# Altium schematic sheet Schematic_motor_driver_v1.SchDoc: Motor Controller Board
size B; Author: Artem Dementyev; Revision: 1.0
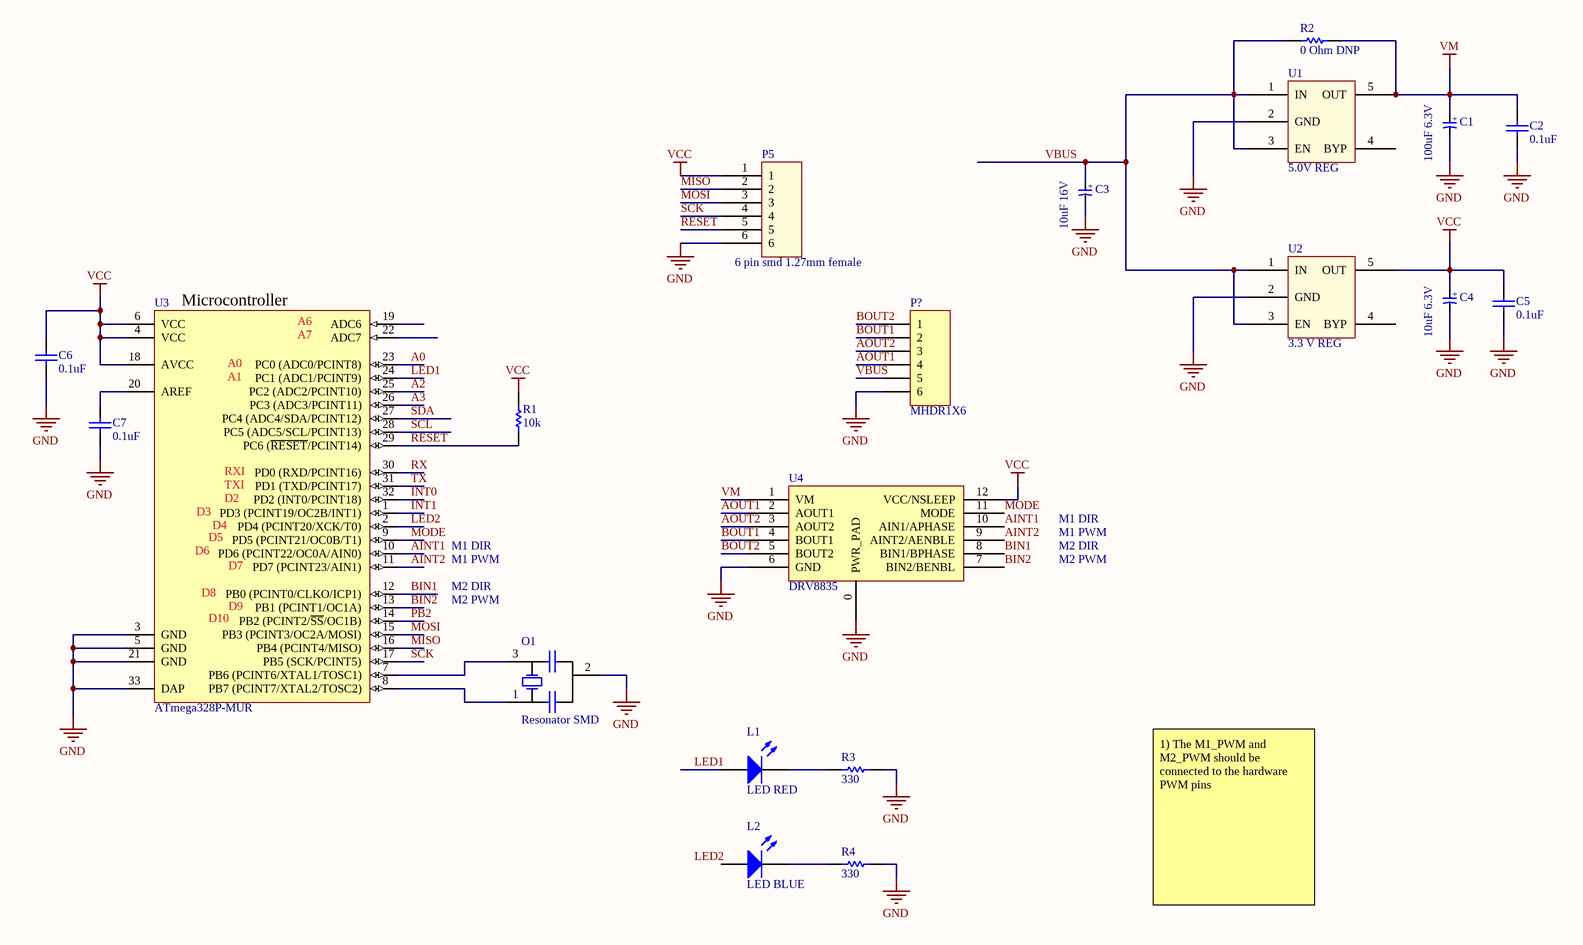
[diagram p0: Schematic_motor_driver_v1.SchDoc]

## Parts
C1  100uF 6.3V  [CAP1206]
C2  0.1uF  [0402W]
C3  10uF 16V  [CAP0805]
C4  10uF 6.3V  [CAP0805]
C5  0.1uF  [0402W]
C6  0.1uF  [0402W]
C7  0.1uF  [0402W]
L1  LED RED  [0402W]
L2  LED BLUE  [0402W]
O1  Resonator SMD  [Resonator SMD]
P5  6 pin smd 1.27mm female  [6pos 1.27mm]
P?  MHDR1X6  [MHDR1X6]
R1  10k  [0402W]
R2  0 Ohm DNP  [0402W]
R3  330  [0402W]
R4  330  [0402W]
U1  5.0V REG  [SOT-23-5]
U2  3.3 V REG  [SOT-23-5]
U3  ATmega328P-MUR  [32M1-A_M]
U4  DRV8835  [WSON-16]

## Nets
GND: C1.2 C2.1 C3.2 C4.2 C5.1 C6.1 C7.1 O1.2 P5.6 P?.6 R3.1 R4.1 U1.2(GND) U2.2(GND) U3.3(GND) U3.5(GND) U3.21(GND) U3.33(DAP) U4.0(PWR_PAD) U4.6(GND)
VCC: C4.1 C5.2 C6.2 P5.1 R1.2 U2.5(OUT) U3.4(VCC) U3.6(VCC) U3.18(AVCC) U4.12(VCC/NSLEEP)
VM: C1.1 C2.2 R2.1 U1.5(OUT) U4.1(VM)
A0: U3.23(PC0_(ADC0/PCINT8))
A2: U3.25(PC2_(ADC2/PCINT10))
A3: U3.26(PC3_(ADC3/PCINT11))
AINT1: U3.10(PD6_(PCINT22/OC0A/AIN0)) U4.10(AIN1/APHASE)
AINT2: U3.11(PD7_(PCINT23/AIN1)) U4.9(AINT2/AENBLE)
AOUT1: P?.4 U4.2(AOUT1)
AOUT2: P?.3 U4.3(AOUT2)
BIN1: U3.12(PB0_(PCINT0/CLKO/ICP1)) U4.8(BIN1/BPHASE)
BIN2: U3.13(PB1_(PCINT1/OC1A)) U4.7(BIN2/BENBL)
BOUT1: P?.2 U4.4(BOUT1)
BOUT2: P?.1 U4.5(BOUT2)
INT0: U3.32(PD2_(INT0/PCINT18))
INT1: U3.1(PD3_(PCINT19/OC2B/INT1))
LED1: L1.1(A) U3.24(PC1_(ADC1/PCINT9))
LED2: U3.2(PD4_(PCINT20/XCK/T0))
MISO: P5.2 U3.16(PB4_(PCINT4/MISO))
MODE: U3.9(PD5_(PCINT21/OC0B/T1)) U4.11(MODE)
MOSI: P5.3 U3.15(PB3_(PCINT3/OC2A/MOSI))
PB2: U3.14(PB2_(PCINT2/~{SS}/OC1B))
RESET: P5.5 R1.1 U3.29(PC6_(~{RESET}/PCINT14))
RX: U3.30(PD0_(RXD/PCINT16))
SCK: P5.4 U3.17(PB5_(SCK/PCINT5))
SCL: U3.28(PC5_(ADC5/SCL/PCINT13))
SDA: U3.27(PC4_(ADC4/SDA/PCINT12))
TX: U3.31(PD1_(TXD/PCINT17))
VBUS: C3.1 P?.5 R2.2 U1.1(IN) U1.3(EN) U2.1(IN) U2.3(EN)
NetC7_2: C7.2 U3.20(AREF)
NetL1_2: L1.2(K) R3.2
NetL2_2: L2.2(K) R4.2
NetO1_1: O1.1 U3.8(PB7_(PCINT7/XTAL2/TOSC2))
NetO1_3: O1.3 U3.7(PB6_(PCINT6/XTAL1/TOSC1))

Not connected (* = marked no-connect by the designer): L2 1(A); U1 4(BYP); U2 4(BYP); U3 19(ADC6) 22(ADC7)

## Notes on the sheet
- (near U3) Microcontroller
- (near U3) A6
- (near U3) A7
- (near U3) A0
- (near U3) A1
- (near U3) A2
- (near U3) A3
- (near U3) A4
- (near U3) A5
- (near U3) D3
- (near U3) D5
- (near U3) D4
- (near U3) RXI
- (near U3) TXI
- (near U3) D2
- M1 PWM
- M1 DIR
- (near U3) D6
- (near U3) D8
- (near U3) D7
- M2 DIR
- M2 PWM
- (near U3) D10
- (near U3) D9
- 1) The M1_PWM and M2_PWM should be connected to the hardware PWM pins
- Labels drawn without touching a wire or pin: LED2
- Title
- Designed by
- Ver
- Date:
- Time:
- (in symbol Capacitor_pol) +

## Library data of the parts
C1 C3 C4 = Capacitor_pol: Polarised capacitor
  C1: digikey part number 1206: 718-1920-1-ND; digikey part numbe 0805: 478-6613-2-ND
  C3: digikey part number: 478-8654-1-ND
  C4: digikey part number: 478-9265-1-ND
C2 C5-C7 = Capacitor: SMD Cap 1206
  C6 C7: digikey number: 490-1532-1-ND
L1 L2 = LED: LED SMD 1206/0603; Sparkfun green: PRT-12622; Sparkfun blue: PRT-12620
O1 = Resonator SMD: Build in caps; digikey number: 490-1195-1-ND
P? = MHDR1X6: Header, 6-Pin; LatestRevisionDate: 17-Jul-2002; LatestRevisionNote: Re-released for DXP Platform.; Publisher: Altium Limited
R1-R4 = Resistor: digikey number: RMCF0603FT10K0CT-ND
U1 U2 = MIC5205_VOLTAGE_REG: 5V LDO SMD
  U1: digikey number: 576-2770-1-ND
  U2: Sparkfun #: PRT-1125; digikey number: 576-1259-1-ND
U3 = ATmega328P-MUR: 8-bit AVR Microcontroller, 32KB Flash, 1KB EEPROM, 2KB SRAM, 32-pin MLF, Industrial Grade (-40°C to 85°C); digikey number: ATMEGA328P-MURCT-ND
U4 = DRV8835: manufacturer: Texas Instruments; manufacturer part number: DRV8835DSSR; digikey part number: 296-30391-1-ND
P5 = 6 pin smd 1.27mm female: digikey number: ED90490-ND